# EAGLE design pidplate-mk-2 (EAGLE 6.5.0)
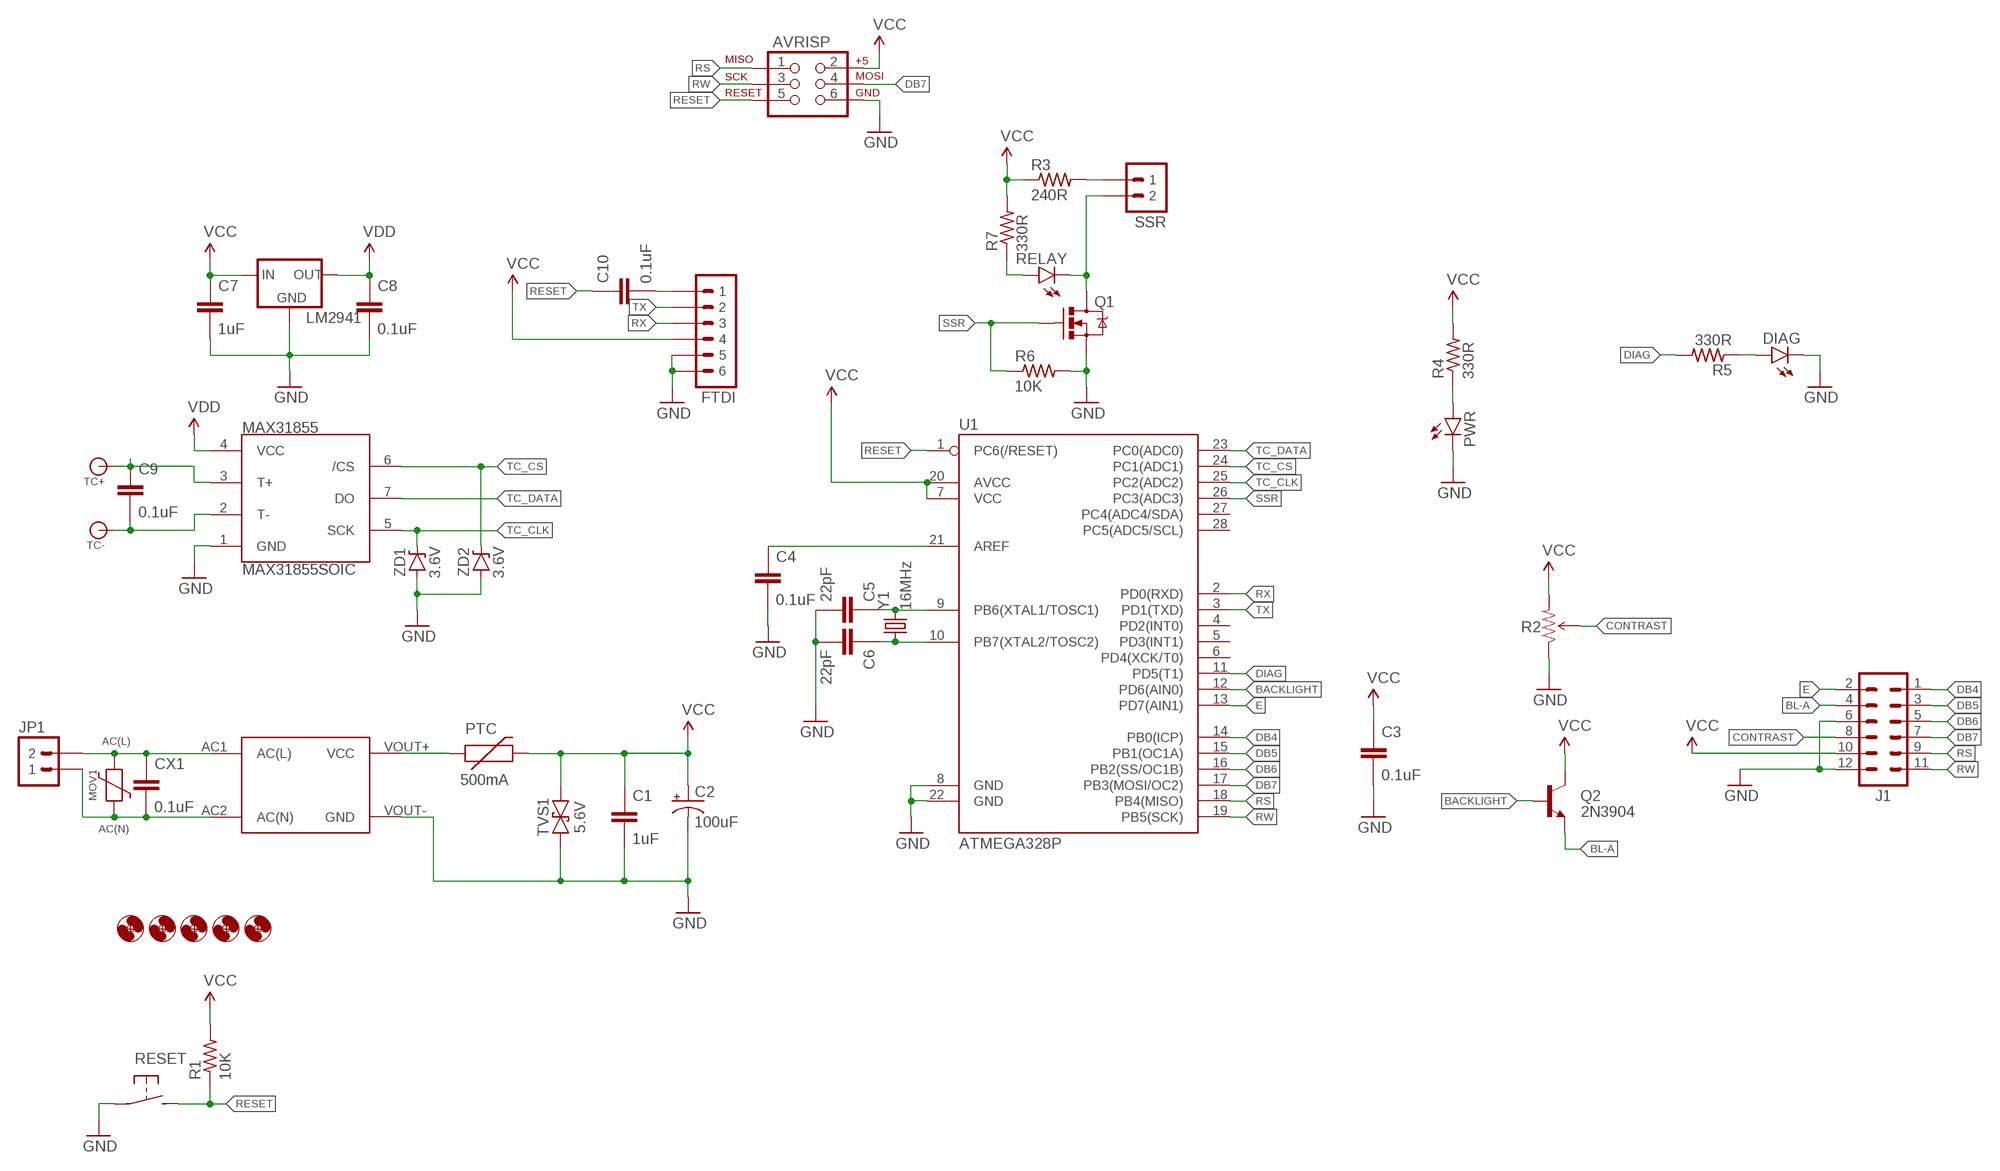
[diagram p0: schematic, sheet 1]

## Parts
AVRISP  AVR_SPI_PRG_6PTH  [2X3]
C1  1uF  CAPACITOR-CERAMIC025-024X044  [C025-024X044]
C2  100uF  CAPACITOR-POLARIZEDE2.5-7  [E2,5-7]
C3  0.1uF  CAPACITOR-CERAMIC025-024X044  [C025-024X044]
C4  0.1uF  CAPACITOR-CERAMIC025-024X044  [C025-024X044]
C5  22pF  CAPACITOR-CERAMIC025-024X044  [C025-024X044]
C6  22pF  CAPACITOR-CERAMIC025-024X044  [C025-024X044]
C7  1uF  CAPACITOR-CERAMIC025-024X044  [C025-024X044]
C8  0.1uF  CAPACITOR-CERAMIC025-024X044  [C025-024X044]
C9  0.1uF  CAPACITOR-CERAMIC025-024X044  [C025-024X044]
C10  0.1uF  CAPACITOR-CERAMIC025-024X044  [C025-024X044]
CX1  0.1uF  CXXC10B5  [XC10B5]
DIAG  LED3MM  [LED3MM]
FTDI  M06SIP  [1X06]
H1  HOLE#2  [HOLE-#2]
H2  HOLE#2  [HOLE-#2]
H3  HOLE#2  [HOLE-#2]
H4  HOLE#2  [HOLE-#2]
H5  HOLE#2  [HOLE-#2]
J1  M06X2PTH  [2X6_PTH]
JP1  M023.5MM  [SCREWTERMINAL-3.5MM-2]
LM2941  L2941  V_REG_78XXTO-92-INLINE  [TO-92-AMMO]
MAX31855  MAX31855SOIC  [SOIC127P600X175-8N]
MOV1  VARISITORVAR-5.08MM-PTH  [VAR-5.08MM-PTH]
PTC  500mA  PTCPTH  [PTC]
PWR  LED3MM  [LED3MM]
Q1  2N7000  MOSFET-NCHANNEL2N7000-AMMO  [TO-92-AMMO]
Q2  2N3904  TRANSISTOR_NPNTO-92-AMMO-CBE  [TO-92-AMMO]
R1  10K  RESISTORPTH-AXIAL-5.08MM  [RESISTOR-AXIAL-PTH-5.08MM]
R2  20K  TRIMPOTPTH  [TRIM_POT_PTH]
R3  240R  RESISTORPTH-AXIAL-6.35MM  [RESISTOR-AXIAL-PTH-6.35MM]
R4  330R  RESISTORPTH-AXIAL-5.08MM  [RESISTOR-AXIAL-PTH-5.08MM]
R5  330R  RESISTORPTH-AXIAL-5.08MM  [RESISTOR-AXIAL-PTH-5.08MM]
R6  10K  RESISTORPTH-AXIAL-6.35MM  [RESISTOR-AXIAL-PTH-6.35MM]
R7  330R  RESISTORPTH-AXIAL-5.08MM  [RESISTOR-AXIAL-PTH-5.08MM]
RELAY  LED3MM  [LED3MM]
RESET  SPST-NO-TACT3MM-RA  [TACTILE-PTH-SIDE]
SSR  M02JST-PTH-VERT  [JST-2-PH-VERT-PTH]
TC+  BANANA_CONNPTH-RA  [BANANA-PTH-RA-SAFEWORD]
TC-  BANANA_CONNPTH-RA  [BANANA-PTH-RA-SAFEWORD]
TVS1  5.6V  TVSDO-41-TVS-BIDIRECTIONAL  [DO-41-TVS]
U1  ATMEGA328P  ATMEGA328P_PDIP  [DIL28-3]
U3  VSK-S1  [VSK-S1]
Y1  16MHz  CRYSTALHC49UV  [HC49U-V]
ZD1  3.6V  DIODE-ZENERPTH-7.68MM  [DIODE-7.68MM]
ZD2  3.6V  DIODE-ZENERPTH-7.68MM  [DIODE-7.68MM]

## Nets
AC(L): CX1.1 JP1.2 MOV1.2 U3.AC1(AC(L))
AC(N): CX1.2 JP1.1 MOV1.1 U3.AC2(AC(N))
BACKLIGHT: Q2.2(B) U1.12(PD6(AIN0))
BL-A: J1.4 Q2.3(E)
CONTRAST: J1.8 R2.2(WIPER)
DB4: J1.1 U1.14(PB0(ICP))
DB5: J1.3 U1.15(PB1(OC1A))
DB6: J1.5 U1.16(PB2(SS/OC1B))
DB7: AVRISP.4 J1.7 U1.17(PB3(MOSI/OC2))
DIAG: R5.P$2 U1.11(PD5(T1))
E: J1.2 U1.13(PD7(AIN1))
GND: AVRISP.6 C1.2 C2.- C3.2 C4.2 C5.2 C6.2 C7.2 C8.2 DIAG.K(C) FTDI.5 FTDI.6 J1.6 J1.12 LM2941.2(GND) MAX31855.1(GND) PWR.K(C) Q1.1(S) R2.1(CCW) R6.P$2 RESET.1 TVS1.P$1 U1.8(GND) U1.22(GND) U3.VOUT-(GND) ZD1.A ZD2.A
N$1: PTC.P$1 U3.VOUT+(VCC)
N$2: DIAG.A R5.P$1
N$3: C6.1 U1.10(PB7(XTAL2/TOSC2)) Y1.1
N$4: C5.1 U1.9(PB6(XTAL1/TOSC1)) Y1.2
N$5: C4.1 U1.21(AREF)
N$6: R3.P$2 SSR.1
N$7: C9.2 MAX31855.2(T-) TC-.P$1 TC-.P$2
N$8: C9.1 MAX31855.3(T+) TC+.P$1 TC+.P$2
N$9: Q1.3(D) RELAY.K(C) SSR.2
N$10: PWR.A R4.P$1
N$13: R7.P$1 RELAY.A
N$14: C10.2 FTDI.1
RESET: AVRISP.5 C10.1 R1.P$1 RESET.2 U1.1(PC6(/RESET))
RS: AVRISP.1 J1.9 U1.18(PB4(MISO))
RW: AVRISP.3 J1.11 U1.19(PB5(SCK))
RX: FTDI.3 U1.2(PD0(RXD))
SSR: Q1.2(G) R6.P$1 U1.26(PC3(ADC3))
TC_CLK: MAX31855.5(SCK) U1.25(PC2(ADC2)) ZD1.K(C)
TC_CS: MAX31855.6(/CS) U1.24(PC1(ADC1)) ZD2.K(C)
TC_DATA: MAX31855.7(DO) U1.23(PC0(ADC0))
TX: FTDI.2 U1.3(PD1(TXD))
VCC: AVRISP.2 C1.1 C2.+ C3.1 C7.1 FTDI.4 J1.10 LM2941.1(IN) PTC.P$2 Q2.1(C) R1.P$2 R2.3(CW) R3.P$1 R4.P$2 R7.P$2 TVS1.P$2 U1.7(VCC) U1.20(AVCC)
VDD: C8.1 LM2941.3(OUT) MAX31855.4(VCC)
Unconnected: U1.4(PD2(INT0)) U1.5(PD3(INT1)) U1.6(PD4(XCK/T0)) U1.27(PC4(ADC4/SDA)) U1.28(PC5(ADC5/SCL))

## Library data of the parts
AVRISP = A_butts:AVR_SPI_PRG_6: AVR ISP 6 Pin This is the reduced ISP connector for AVR programming. Common on Arduino. This footprint will take up less PCB space and can be used with a 10-pin to 6-pin adapter such as SKU: BOB-08508 **Special note about "TEST_POINT" package. The stop mask is on the top side, so if you want your programming test points to be on the bottom of your board, make sure to place this package on the bottom side of the board. This also ensure that the orientation to program from the bottom side will be correct.
C1 C3-C10 = A_butts:CAPACITOR-CERAMIC: CAPACITOR, European symbol
C2 = A_butts:CAPACITOR-POLARIZED: POLARIZED CAPACITOR, American symbol
CX1 = A_butts:CX: X CAPACITOR for power line
DIAG PWR RELAY = A_butts:LED: LEDs Standard schematic elements and footprints for 5mm, 3mm, 1206, and 0603 sized LEDs. 5mm - Spark Fun Electronics SKU : COM-00529 (and others)
FTDI = A_butts:M06: Header 6 Standard 6-pin 0.1" header. Use with straight break away headers (SKU : PRT-00116), right angle break away headers (PRT-00553), swiss pins (PRT-00743), machine pins (PRT-00117), and female headers (PRT-00115). Molex polarized connector foot print use with SKU : PRT-08094 with associated crimp pins and housings. NOTES ON THE VARIANTS LOCK and LOCK_LONGPADS... This footprint was designed to help hold the alignment of a through-hole component (i.e. 6-pin header) while soldering it into place. You may notice that each hole has been shifted either up or down by 0.005 of an inch from it's more standard position (which is a perfectly straight line). This slight alteration caused the pins (the squares in the middle) to touch the edges of the holes. Because they are alternating, it causes a "brace" to hold the component in place. 0.005 has proven to be the perfect amount of "off-center" position when using our standard breakaway headers. Although looks a little odd when you look at the bare footprint, once you have a header in there, the alteration is very hard to notice. Also,if you push a header all the way into place, it is covered up entirely on the bottom side. This idea of altering the position of holes to aid alignment will be further integrated into the Sparkfun Library for other footprints. It can help hold any component with 3 or more connection pins.
H1-H5 = A_butts:HOLE: MOUNTING HOLE with drill center marker
J1 = A_butts:M06X2
JP1 SSR = A_butts:M02: Standard 2-pin 0.1" header. Use with - straight break away headers ( PRT-00116) - right angle break away headers (PRT-00553) - swiss pins (PRT-00743) - machine pins (PRT-00117) - female headers (PRT-00115) Molex polarized connector foot print use with: PRT-08233 with associated crimp pins and housings. 2.54_SCREWTERM for use with PRT-10571. 3.5mm Screw Terminal footprints for PRT-08084 5mm Screw Terminal footprints for use with PRT-08433
LM2941 = A_butts:V_REG_78XX: Voltage Regulator Standard 7805 5V regulator. IGO (Input Ground Output). Spark Fun Electronics SKU : COM-00107
MAX31855 = A_butts:MAX31855
MOV1 = A_butts:VARISITOR
PTC = A_butts:PTC: Resettable Fuse PTC Resettable Fuse. Spark Fun Electronics SKU : COM-08357
Q1 = A_butts:MOSFET-NCHANNEL: Common NMOSFET Parts MFG P/N Store ID Prod ID FDD8780 TRANS-09984 SI7820DN TRANS-11055 FDS6630A IC-08089 2N7002PW TRANS-11151 FQP30N06L COM-10213 TRANS-10060 BSS123LT1G TRANS-08345 BSS138 TRANS-00830 BS170 2N7000
Q2 = A_butts:TRANSISTOR_NPN: Generic NPN BJT MMBT2222A - TRANS-08049 (SOT-23, 1A 40V) MPSA42 - TRANS-09116 (SOT-23, 500mA 300V) MMBT5088LT1G - TRANS-11160 (SOT-23, 50 mA 30V) BC547 - COM-08928 <http://www.sparkfun.com/products/8928> (TO-92 45V 100mA) (1.Collector 2.Base 3.Emitter) 2N3904 - COM-00521 <http://www.sparkfun.com/products/521> (TO-92 40V 200mA) (1.Emitter 2.Base 3.Collector) P2N2222A - COM-12852 <http://www.sparkfun.com/products/12852> (TO-92 40V 600mA) (1.Collector 2.Base 3.Emitter)
R1 R3-R7 = A_butts:RESISTOR: RESISTOR, American symbol
R2 = A_butts:TRIMPOT: Various small potentiometers for "set-and-forget" applications
RESET = A_butts:SPST-NO-TACT
TC+ TC- = A_butts:BANANA_CONN: Through-hole banana jack
TVS1 = A_butts:TVS: Transient voltage suppressor- prevents ESD on inputs. Ignore package description- MBRA140 is NOT this type of part!!!
U1 = A_butts:ATMEGA328P_PDIP: uC used in the Arduino 32kb flash, 1k EEPROM, 2k SRAM This is the through-hole version of this chip.
U3 = A_butts:VSK-S1: VSK-S1 is an AC/DC converter for PCB mounting.
Y1 = A_butts:CRYSTAL: Various standard crystals. Proven footprints. Spark Fun Electronics SKU : COM-00534
ZD1 ZD2 = A_butts:DIODE-ZENER: Zener Diode Production Part - 8199 3.4V Zener Voltage

## Board
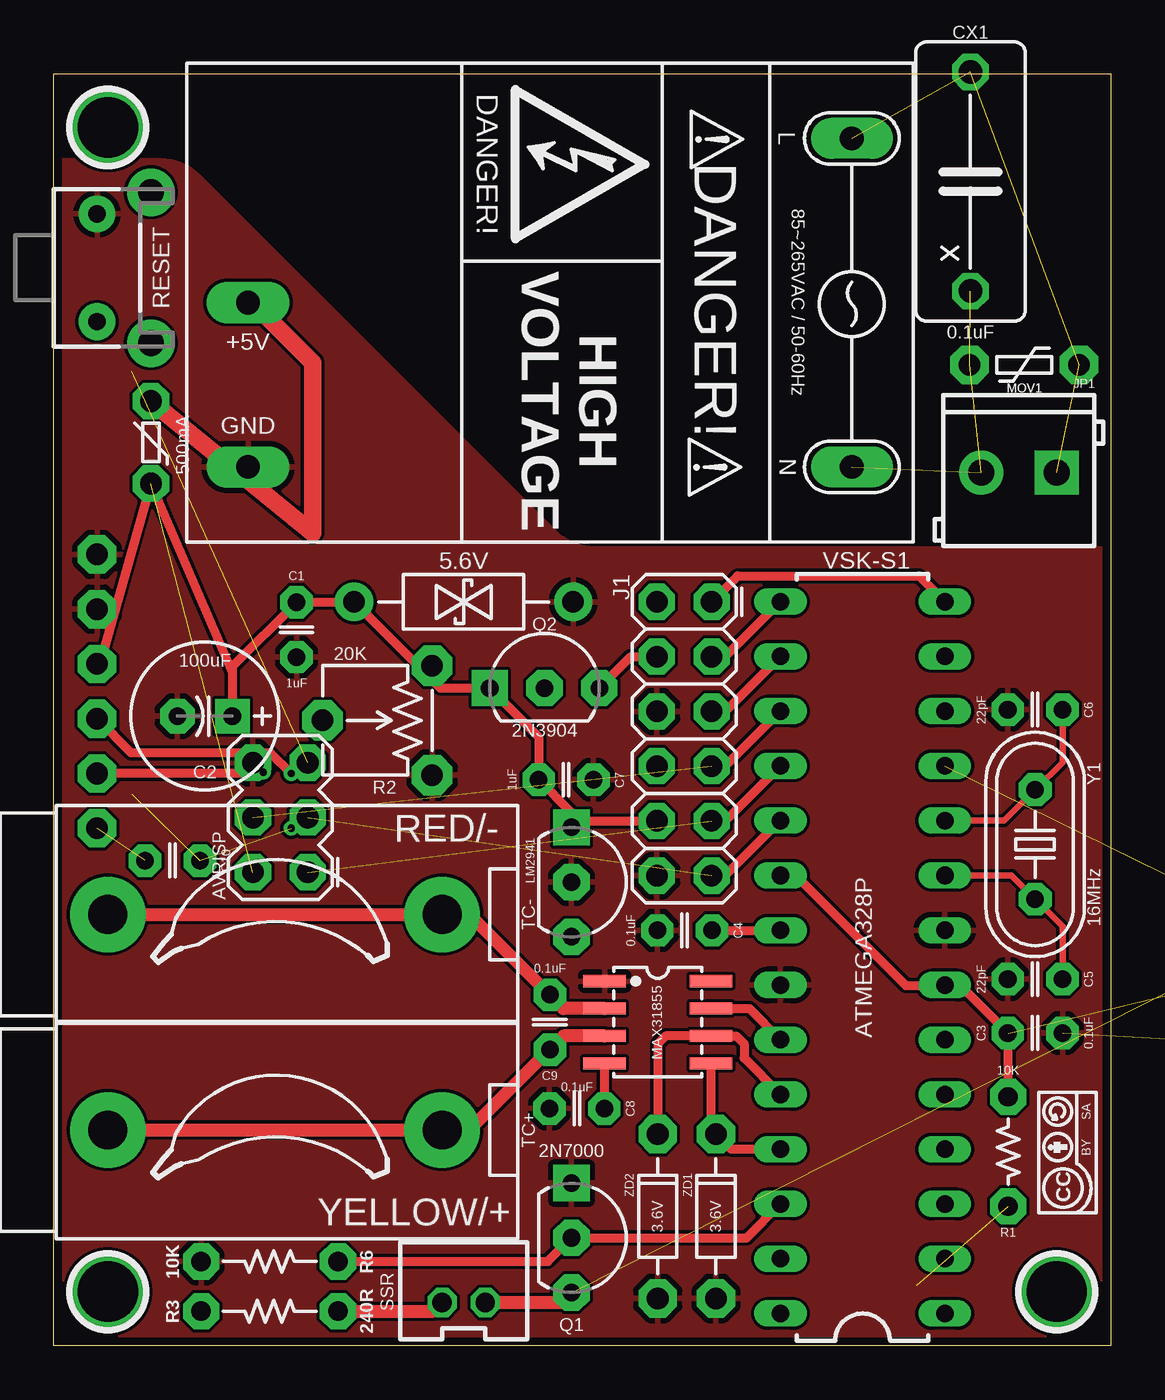
[diagram p1: board, top side]
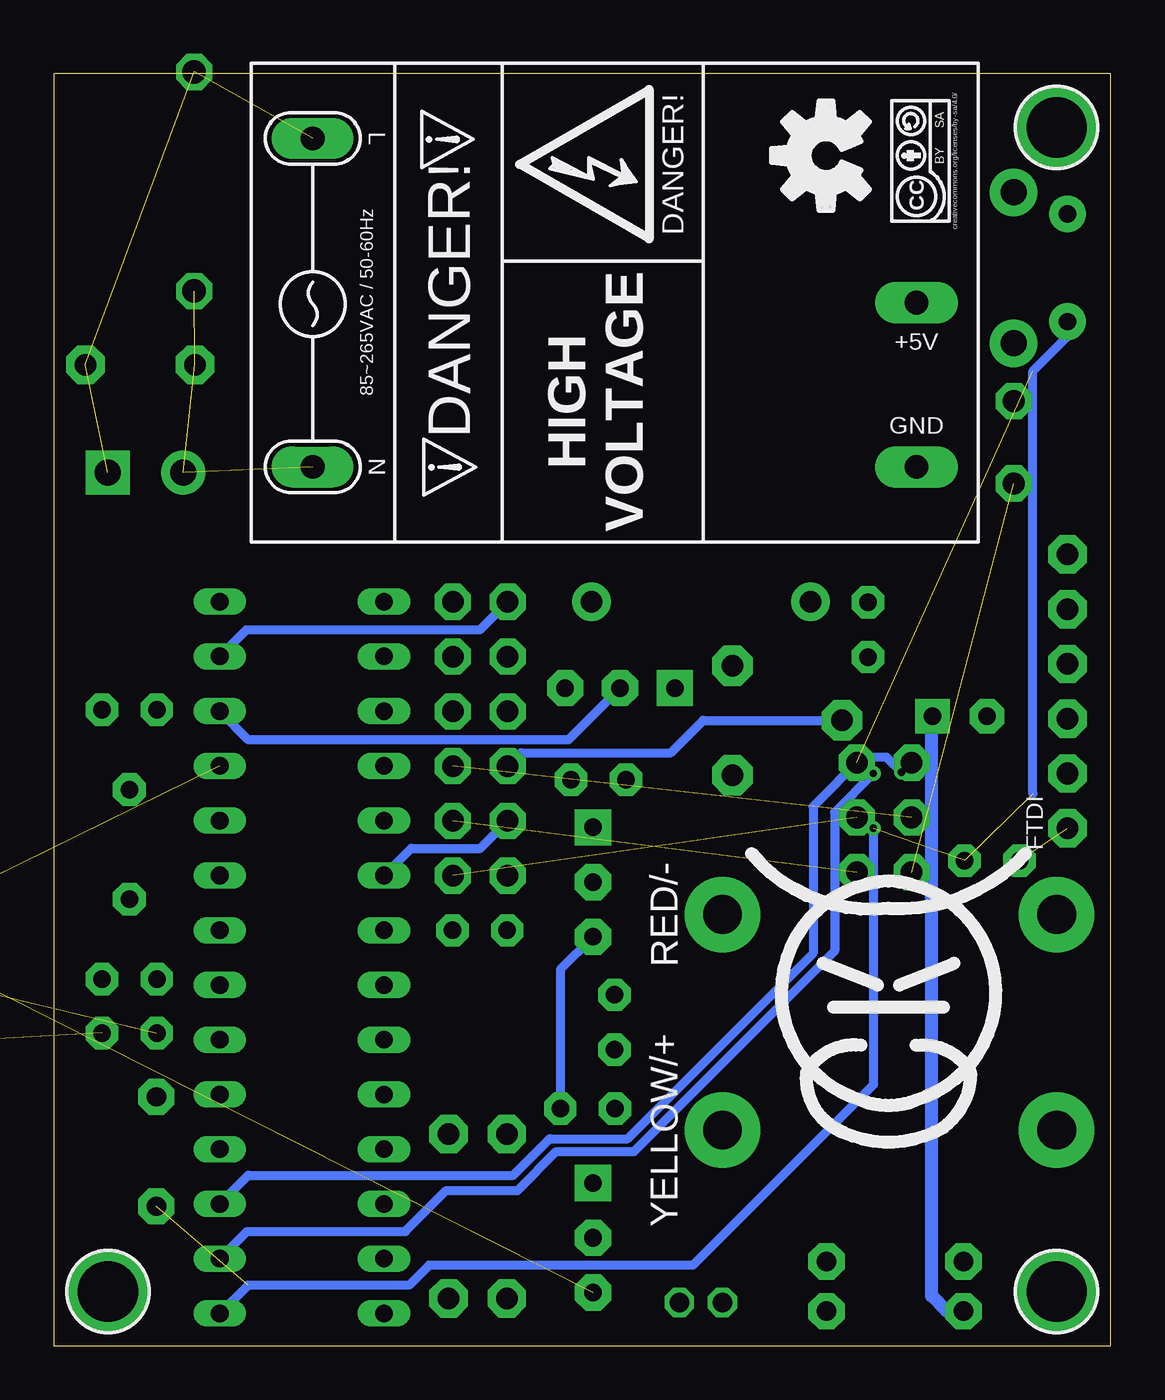
[diagram p2: board, bottom side, seen from below]

Size 49 x 59 mm. Coordinates in mm from the lower left corner, seen from the top.
Outline: 0,59 49,59 49,0 0,0 0,59
Copper layers (1*16): Top 0.0356mm / dielectric 1.5011mm / Bottom 0.0356mm
Design rules "LaenPCBOrder2": minimum track width 6mil, minimum drill 13mil, track to track 6mil, track to pad 6mil, pad to pad 6mil, via to via 6mil, smd to smd 6mil, copper to edge 15mil, drill to drill 6mil, minimum pad ring 7mil, minimum via ring 7mil, stop-mask expansion 3mil, vias tented up to drill 20mil, thermal gap 10mil

### Footprints (pad centres in the part's own frame; a part is rotated, then mirrored left to right if it is on the bottom)
2X3 = drill 1 pad 1.676 octagon: 1 -2.54,-1.27; 2 -2.54,1.27; 3 0,-1.27; 4 0,1.27; 5 2.54,-1.27; 6 2.54,1.27
C025-024X044 = drill 0.813 pad 1.5 octagon: 1 -1.27,0; 2 1.27,0
E2,5-7 = drill 0.813 pad 1.6 square: + -1.27,0 | drill 0.813 pad 1.6 octagon: - 1.27,0
XC10B5 = drill 1.1 pad 1.676 octagon: 1 -5.08,0; 2 5.08,0
LED3MM = drill 1 pad 1.524 square: A -1.27,0 | drill 1 pad 1.524 octagon: K 1.27,0
1X06 = drill 1 pad 1.778 octagon: 1 0,0; 2 2.54,0; 3 5.08,0; 4 7.62,0; 5 10.16,0; 6 12.7,0
HOLE-#2 = drill 2.8 pad 3.81: P$1 0,0
2X6_PTH = drill 1 pad 1.676 octagon: 1 0,0; 2 0,-2.54; 3 2.54,0; 4 2.54,-2.54; 5 5.08,0; 6 5.08,-2.54; 7 7.62,0; 8 7.62,-2.54; 9 10.16,0; 10 10.16,-2.54; 11 12.7,0; 12 12.7,-2.54
SCREWTERMINAL-3.5MM-2 = drill 1.2 pad 2.032 square: 1 0,0 | drill 1.2 pad 2.032: 2 3.5,0
TO-92-AMMO = drill 0.813 pad 1.676 square: 1 -2.54,0 | drill 0.813 pad 1.676 octagon: 2 0,0; 3 2.54,0
SOIC127P600X175-8N = smd 1.981 x 0.559: 1 -2.464,1.905; 2 -2.464,0.635; 3 -2.464,-0.635; 4 -2.464,-1.905; 5 2.464,-1.905; 6 2.464,-0.635; 7 2.464,0.635; 8 2.464,1.905
VAR-5.08MM-PTH = drill 1 pad 1.778 octagon: 1 -2.54,0; 2 2.54,0
PTC = drill 1.016 pad 1.676 octagon: P$1 -1.905,0; P$2 1.905,0
RESISTOR-AXIAL-PTH-5.08MM = drill 0.9 pad 1.676 octagon: P$1 -2.54,0; P$2 2.54,0
TRIM_POT_PTH = drill 1 pad 1.88 octagon: 1 -2.54,-2.54; 2 0,2.54; 3 2.54,-2.54
RESISTOR-AXIAL-PTH-6.35MM = drill 0.9 pad 1.676 octagon: P$1 -3.175,0; P$2 3.175,0
TACTILE-PTH-SIDE = drill 0.8 pad 1.7: 1 -2.5,0; 2 2.5,0 | drill 1.2 pad 2.2: ANCHOR1 -3.5,2.5; ANCHOR2 3.5,2.5
JST-2-PH-VERT-PTH = drill 0.9 octagon: 1 -1,0; 2 1,0
BANANA-PTH-RA-SAFEWORD = drill 1.8 pad 3.5: P$1 0,0; P$2 15.5,0
DO-41-TVS = drill 1 pad 1.778: P$1 -5.08,0; P$2 5.08,0
DIL28-3 = drill 0.813 long: 1 -16.51,-3.81; 2 -13.97,-3.81; 3 -11.43,-3.81; 4 -8.89,-3.81; 5 -6.35,-3.81; 6 -3.81,-3.81; 7 -1.27,-3.81; 8 1.27,-3.81; 9 3.81,-3.81; 10 6.35,-3.81; 11 8.89,-3.81; 12 11.43,-3.81; 13 13.97,-3.81; 14 16.51,-3.81; 15 16.51,3.81; 16 13.97,3.81; 17 11.43,3.81; 18 8.89,3.81; 19 6.35,3.81; 20 3.81,3.81; 21 1.27,3.81; 22 -1.27,3.81; 23 -3.81,3.81; 24 -6.35,3.81; 25 -8.89,3.81; 26 -11.43,3.81; 27 -13.97,3.81; 28 -16.51,3.81
VSK-S1 = drill 1.1 pad 1.9 long: AC1 0,15.24; AC2 0,0 | drill 1.1 pad 1.93 long: VOUT+ 28,7.62; VOUT- 28,15.24
HC49U-V = drill 0.813 pad 1.524 octagon: 1 -2.54,0; 2 2.54,0
DIODE-7.68MM = drill 1 pad 1.778 octagon: A -3.81,0; K 3.81,0

### Placement (x,y rotation side)
AVRISP  10.5,24.5 90 top
C1  11.25,33.21 270 top
C2  7,29.2 180 top
C3  45.5,14.5 0 top
C4  29.25,19.26 180 top
C5  45.5,17 180 top
C6  45.5,29.5 180 top
C7  23.75,26.25 0 top
C8  24.25,11 180 top
C9  23,15 90 top
C10  5.5,22.5 180 top
CX1  42.5,54 90 top
DIAG  54.5,14 0 top  (outside the outline)
FTDI  2,24 90 bottom
H1  61.5,42 0 top  (outside the outline)
H2  2.5,56.5 0 top
H3  2.5,2.5 0 top
H4  46.5,2.5 0 top
H5  62.5,40 0 top  (outside the outline)
J1  30.5,34.5 270 top
JP1  46.5,40.5 180 top
LM2941  24,21.5 270 top
MAX31855  28,15 0 top
MOV1  45,45.5 180 top
PTC  4.5,41.9 270 top
PWR  54.5,23.5 0 top  (outside the outline)
Q1  24,5 270 top
Q2  22.75,30.5 0 top
R1  44.25,9 90 top
R2  15,29 90 top
R3  10,1.6 0 top
R4  62.3,23 0 top  (outside the outline)
R5  64,14.5 0 top  (outside the outline)
R6  10,3.9 180 top
R7  63.5,18.5 180 top  (outside the outline)
RELAY  54.5,18.5 0 top  (outside the outline)
RESET  2,50 270 top
SSR  19,2 0 top
TC+  18,10 180 top
TC-  18,20 180 top
TVS1  19,34.5 180 top
U1  37.5,18 90 top
U3  37,56 180 top
U$1  [COW]  10.3,15.2 0 bottom
U$2  [CC-BY-SA-4.0-NO-URL]  46.8,7.3 90 top
U$3  [CC-BY-SA-4.0-URL-BOTTOM]  9,53.3 90 bottom
U$4  [OSHWLOGO_BOT_0.2]  13.2,55.2 270 top
Y1  45.5,23.25 270 top
ZD1  30.7,6 90 top
ZD2  28,6 90 top

### Tracks (layer width: path | path; a pad name or v marks a point on that pad's centre or on a via)
AC(L)  (3 unrouted)
AC(N)  (3 unrouted)
BACKLIGHT
  Bottom 0.406: Q2.2 25.15,28.1 39.98,28.1 U1.12
BL-A
  Top 0.406: Q2.3 26.75,31.96 J1.4
CONTRAST
  Bottom 0.406: J1.8 27.34,27.5 20.4,27.5 18.9,29 R2.2
DB4
  Top 0.406: J1.1 31.7,35.7 40.12,35.7 U1.14
DB5
  Top 0.406: J1.3 31.14,31.96 U1.15
DB6
  Top 0.406: J1.5 31.14,29.42 U1.16
DB7  (1 unrouted)
  Top 0.406: J1.7 31.14,26.88 U1.17
DIAG  (1 unrouted)
E
  Bottom 0.406: J1.2 29.26,33.2 40.08,33.2 U1.13
GND  (2 unrouted)
  pour Top: 25.04,37 49,37 49,0 0,0 0,55 4.96,55 arc-45 6.73,54.27 23.27,37.73 arc45
N$1
  Top 0.813: PTC.P$1 12,37.7 12,45.6 9.22,48.38 U3.VOUT+
N$2  (1 unrouted)
N$3
  Top 0.305: U1.10 44.06,24.35 Y1.1 46.77,27.06 C6.1
N$4
  Top 0.305: U1.9 44.4,21.81 Y1.2 46.77,19.44 C5.1
N$5
  Top 0.406: C4.1 U1.21
N$6
  Top 0.61: R3.P$2 17.6,1.6 SSR.1
N$7
  Top 0.61: TC-.P$2 TC-.P$1 19.27,20 C9.2 23.64,15.63 MAX31855.2
N$8
  Top 0.61: TC+.P$2 TC+.P$1 19.27,10 C9.1 23.64,14.37 MAX31855.3
N$9  (1 unrouted)
  Top 0.61: SSR.2 23.54,2 Q1.3
N$10  (1 unrouted)
N$13  (1 unrouted)
N$14  (1 unrouted)
RESET  (via drill 0.33)  (4 unrouted)
  Bottom 0.406: v11,24 11,12.1 19.37,3.73 31.6,3.73 32.53,2.8 40,2.8 U1.1 | 3.6,25.6 3.6,45.2 2,46.8 RESET.2
RS  (1 unrouted)
  Top 0.406: J1.9 31.14,24.34 U1.18
RW  (1 unrouted)
  Top 0.406: J1.11 31.14,21.8 U1.19
RX  (via drill 0.33)
  Top 0.406: v11,26.54 10.04,27.5 3.58,27.5 FTDI.3
  Bottom 0.406: v11,26.54 12.8,24.74 12.8,18.3 22.1,9 25.7,9 27.5,7.2 30.8,7.2 32.7,5.3 40.04,5.3 U1.2
SSR
  Top 0.406: U1.26 32.12,5 Q1.2 22.9,3.9 R6.P$1
TC_CLK
  Top 0.406: U1.25 31.4,9.11 ZD1.K 30.46,10.05 MAX31855.5
TC_CS
  Top 0.406: U1.24 32,13.34 32,14 31.64,14.37 MAX31855.6 28.36,14.37 28,14 ZD2.K
TC_DATA
  Top 0.406: MAX31855.7 32.24,15.63 U1.23
TX  (via drill 0.33)
  Top 0.406: v9.7,26.6 9.64,26.54 FTDI.2
  Bottom 0.406: v9.7,26.6 10.39,27.29 11.51,27.29 13.8,25 13.8,18.2 22.4,9.6 26,9.6 27.7,7.9 39.98,7.9 U1.3
VCC  (3 unrouted)
  Top 0.406: FTDI.4 2.12,31.62 PTC.P$2 8.27,31.23 C2.+ 8.27,31.5 C1.1 11.27,34.5 TVS1.P$2 17.21,31.21 | 17.21,31.21 17.92,30.5 Q2.1 22.48,28.23 C7.1 24,24.73 LM2941.1 24.3,24.34 J1.10 | R2.3 17.21,31.21 | R1.P$2 44.25,14.48 C3.1 42,16.73 U1.7 41.28,16.7 39.5,16.7 34.39,21.81 U1.20
  Bottom 0.406: C2.+ 8.3,29.17 | U1.20 32.43,23.07 29.23,23.07 J1.10
  Bottom 0.61: R3.P$1 7.6,1.6 8.3,2.3 8.3,29.17
VDD
  Top 0.406: MAX31855.4 25.52,13.08 C8.1
  Bottom 0.406: LM2941.3 25.52,17.44 C8.1

### Text on the board
tPlace: RED/- | YELLOW/+
bPlace: RED/- | YELLOW/+